# Altium schematic sheet Buck_60W20V_MCU_AuxPSU.SchDoc
size A4; SheetNumber: 4; SheetTotal: 7
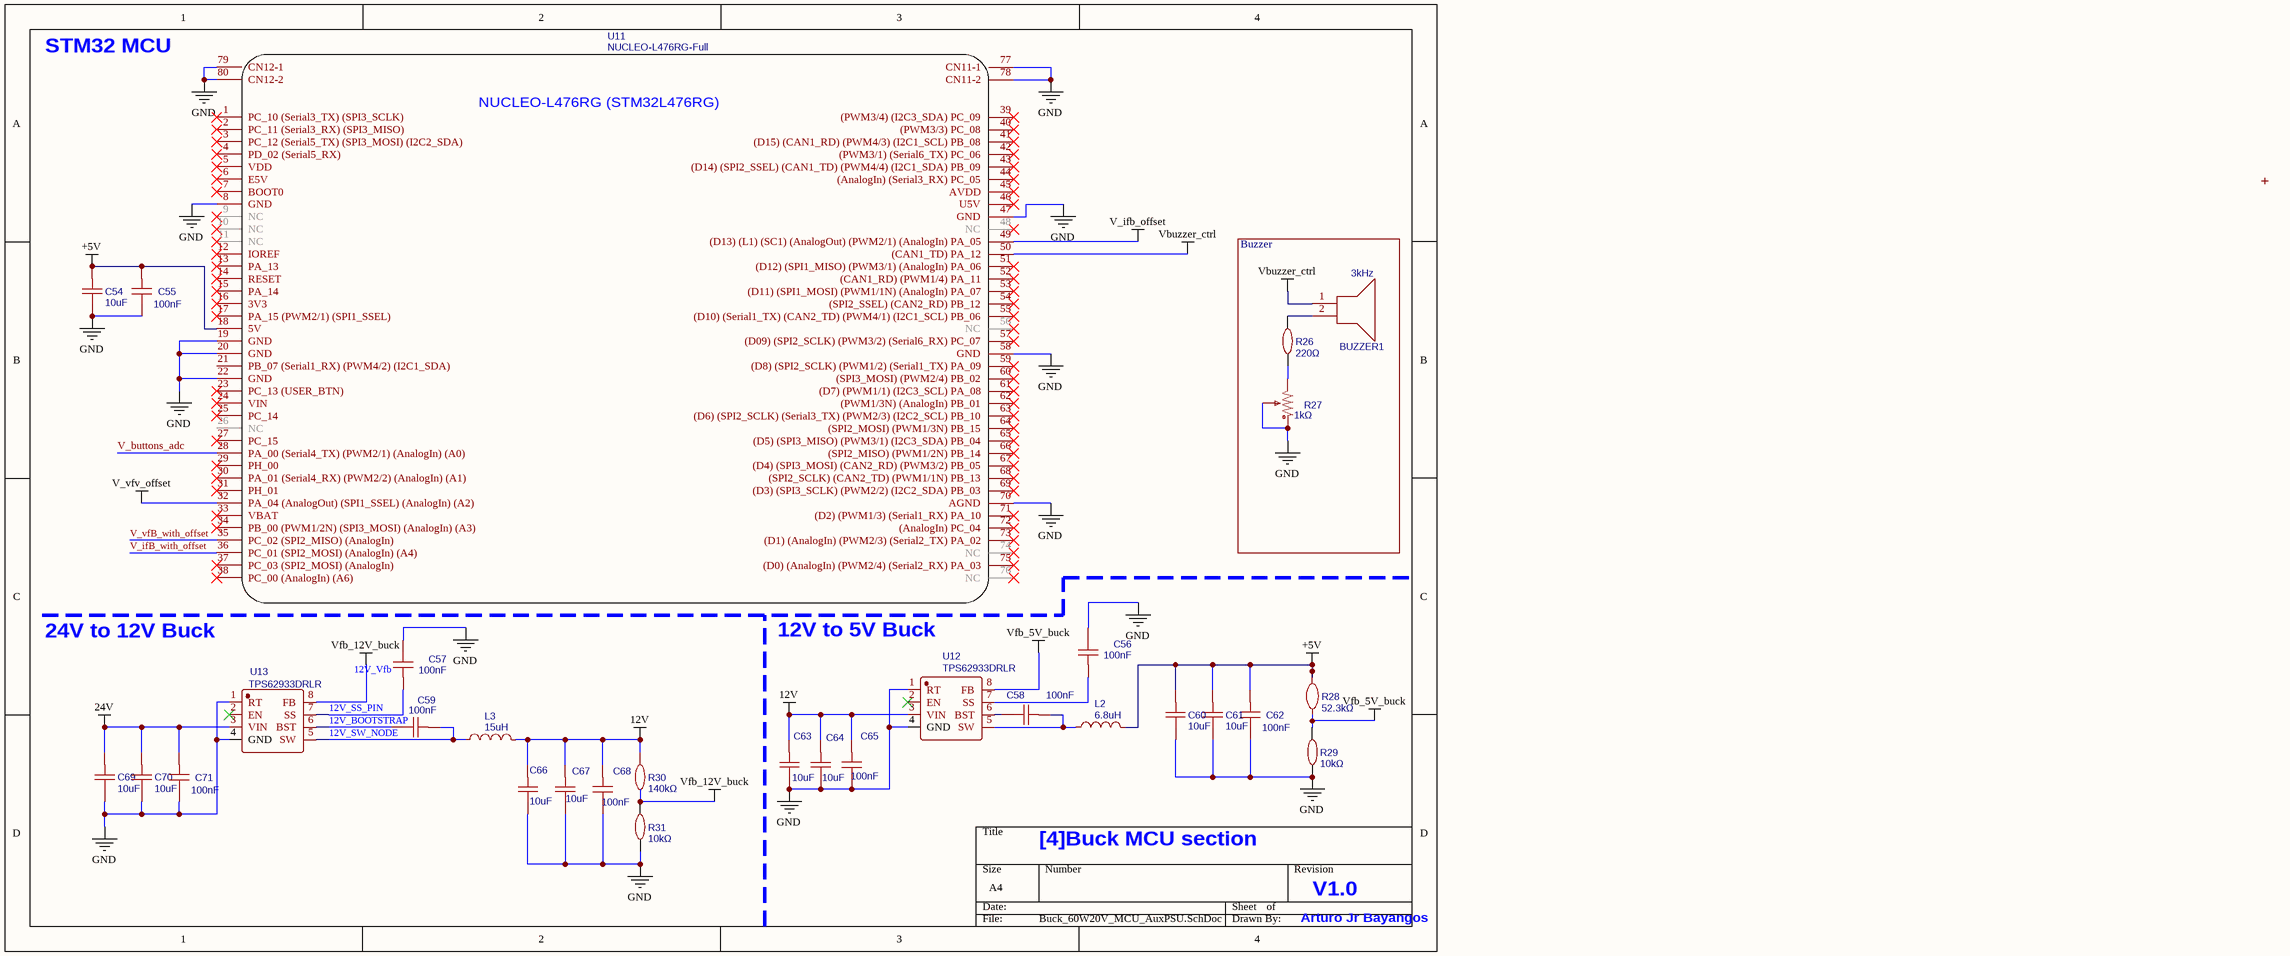
[diagram p0: Buck_60W20V_MCU_AuxPSU.SchDoc]

## Parts
BUZZER1  3kHz  [BUZ-TH_BD9.0-P5.00-D0.6-FD]
C54  10uF  [C1210]
C55  100nF  [C0402]
C56  100nF  [C0402]
C57  100nF  [C0402]
C58  100nF  [C0402]
C59  100nF  [C0402]
C60  10uF  [C1210]
C61  10uF  [C1210]
C62  100nF  [C0402]
C63  10uF  [C1210]
C64  10uF  [C1210]
C65  100nF  [C0402]
C66  10uF  [C1210]
C67  10uF  [C1210]
C68  100nF  [C0402]
C69  10uF  [C1210]
C70  10uF  [C1210]
C71  100nF  [C0402]
L2  6.8uH  [IND-SMD_L3.0-W3.0_LQH3NPN]
L3  15uH  [IND-SMD_L7.2-W6.9]
R26  220Ω  [R0603]
R27  1kΩ  [RES-ADJ-TH_3296W]
R28  52.3kΩ  [R0603]
R29  10kΩ  [R0603]
R30  140kΩ  [R0603]
R31  10kΩ  [R0603]
U11  NUCLEO-L476RG-Full  [MORPHO HEADER L476RG]
U12  TPS62933DRLR  [SOT-583-8_L2.1-W1.2-P0.50-LS1.6-BR]
U13  TPS62933DRLR  [SOT-583-8_L2.1-W1.2-P0.50-LS1.6-BR]

## Blocks framed on the sheet
Buzzer: BUZZER1 R26 R27

## Nets
12V: C63.2 C64.2 C65.2 C66.2 C67.2 C68.2 L3.2 R30.2 U12.3(VIN)
24V: C69.2 C70.2 C71.2 U13.3(VIN)
+5V: C54.2 C55.2 C60.2 C61.2 C62.2 L2.2 R28.2 U11.18(5V)
GND: C54.1 C55.1 C56.1 C57.1 C60.1 C61.1 C62.1 C63.1 C64.1 C65.1 C66.1 C67.1 C68.1 C69.1 C70.1 C71.1 R27.1 R27.2 R29.1 R31.1 U11.8(GND) U11.19(GND) U11.20(GND) U11.22(GND) U11.47(GND) U11.58(GND) U11.70(AGND) U11.77(CN11-1) U11.78(CN11-2) U11.79(CN12-1) U11.80(CN12-2) U12.1(RT) U12.4(GND) U13.1(RT) U13.4(GND)
V_ifb_offset: U11.49((D13)_(L1)_(SC1)_(AnalogOut)_(PWM2/1)_(AnalogIn)_PA_05)
V_vfv_offset: U11.32(PA_04_(AnalogOut)_(SPI1_SSEL)_(AnalogIn)_(A2))
Vbuzzer_ctrl: BUZZER1.1(+) U11.50((CAN1_TD)_PA_12)
Vfb_5V_buck: R28.1 R29.2 U12.8(FB)
Vfb_12V_buck: R30.1 R31.2 U13.8(FB)
12V_BOOTSTRAP: C59.1 U13.6(BST)
12V_SS_PIN: C57.2 U13.7(SS)
12V_SW_NODE: C59.2 L3.1 U13.5(SW)
V_buttons_adc: U11.28(PA_00_(Serial4_TX)_(PWM2/1)_(AnalogIn)_(A0))
V_ifB_with_offset: U11.36(PC_01_(SPI2_MOSI)_(AnalogIn)_(A4))
V_vfB_with_offset: U11.35(PC_02_(SPI2_MISO)_(AnalogIn))
NetBUZZER1_2: BUZZER1.2(-) R26.2
NetC56_2: C56.2 U12.7(SS)
NetC58_1: C58.1 U12.6(BST)
NetC58_2: C58.2 L2.1 U12.5(SW)
NetR26_1: R26.1 R27.3

Not connected (* = marked no-connect by the designer): U11 1(PC_10_(Serial3_TX)_(SPI3_SCLK))* 2(PC_11_(Serial3_RX)_(SPI3_MISO))* 3(PC_12_(Serial5_TX)_(SPI3_MOSI)_(I2C2_SDA))* 4(PD_02_(Serial5_RX))* 5(VDD)* 6(E5V)* 7(BOOT0)* 9(NC)* 10(NC)* 11(NC)* 12(IOREF)* 13(PA_13)* 14(RESET)* 15(PA_14)* 16(3V3)* 17(PA_15_(PWM2/1)_(SPI1_SSEL))* 21(PB_07_(Serial1_RX)_(PWM4/2)_(I2C1_SDA)) 23(PC_13_(USER_BTN))* 24(VIN)* 25(PC_14)* 26(NC) 27(PC_15)* 29(PH_00)* 30(PA_01_(Serial4_RX)_(PWM2/2)_(AnalogIn)_(A1))* 31(PH_01)* 33(VBAT)* 34(PB_00_(PWM1/2N)_(SPI3_MOSI)_(AnalogIn)_(A3))* 37(PC_03_(SPI2_MOSI)_(AnalogIn))* 38(PC_00_(AnalogIn)_(A6))* 39((PWM3/4)_(I2C3_SDA)_PC_09)* 40((PWM3/3)_PC_08)* 41((D15)_(CAN1_RD)_(PWM4/3)_(I2C1_SCL)_PB_08)* 42((PWM3/1)_(Serial6_TX)_PC_06)* 43((D14)_(SPI2_SSEL)_(CAN1_TD)_(PWM4/4)_(I2C1_SDA)_PB_09)* 44((AnalogIn)_(Serial3_RX)_PC_05)* 45(AVDD)* 46(U5V)* 48(NC)* 51((D12)_(SPI1_MISO)_(PWM3/1)_(AnalogIn)_PA_06)* 52((CAN1_RD)_(PWM1/4)_PA_11)* 53((D11)_(SPI1_MOSI)_(PWM1/1N)_(AnalogIn)_PA_07)* 54((SPI2_SSEL)_(CAN2_RD)_PB_12)* 55((D10)_(Serial1_TX)_(CAN2_TD)_(PWM4/1)_(I2C1_SCL)_PB_06)* 56(NC)* 57((D09)_(SPI2_SCLK)_(PWM3/2)_(Serial6_RX)_PC_07)* 59((D8)_(SPI2_SCLK)_(PWM1/2)_(Serial1_TX)_PA_09)* 60((SPI3_MOSI)_(PWM2/4)_PB_02)* 61((D7)_(PWM1/1)_(I2C3_SCL)_PA_08)* 62((PWM1/3N)_(AnalogIn)_PB_01)* 63((D6)_(SPI2_SCLK)_(Serial3_TX)_(PWM2/3)_(I2C2_SCL)_PB_10)* 64((SPI2_MOSI)_(PWM1/3N)_PB_15)* 65((D5)_(SPI3_MISO)_(PWM3/1)_(I2C3_SDA)_PB_04)* 66((SPI2_MISO)_(PWM1/2N)_PB_14)* 67((D4)_(SPI3_MOSI)_(CAN2_RD)_(PWM3/2)_PB_05)* 68((SPI2_SCLK)_(CAN2_TD)_(PWM1/1N)_PB_13)* 69((D3)_(SPI3_SCLK)_(PWM2/2)_(I2C2_SDA)_PB_03)* 71((D2)_(PWM1/3)_(Serial1_RX)_PA_10)* 72((AnalogIn)_PC_04)* 73((D1)_(AnalogIn)_(PWM2/3)_(Serial2_TX)_PA_02)* 74(NC)* 75((D0)_(AnalogIn)_(PWM2/4)_(Serial2_RX)_PA_03)* 76(NC)*; U12 2(EN)*; U13 2(EN)*

## Notes on the sheet
- STM32 MCU
- 24V to 12V Buck
- 12V to 5V Buck
- [4]Buck MCU section
- V1.0
- Arturo Jr Bayangos
- Labels drawn without touching a wire or pin: 12V_Vfb
- (in symbol NUCLEO-L476RG-Full) NUCLEO-L476RG (STM32L476RG)

## Library data of the parts
BUZZER1 = 3kHz: Manufacturer: 华能; Manufacturer Part: HNB09A03; Contributor: LCSC; nameAlias: Value; Supplier: LCSC; Supplier Part: C96102; JLCPCB Part Class: Extended Part; spicePre: B; spiceSymbolName: HNB09A03
C54 C60 C61 C63 C64 C66 C67 C69 C70 = 10uF: Manufacturer: TAIYO YUDEN(太诱); Manufacturer Part: UMK325AB7106KM-T; nameAlias: Capacitance; Contributor: LCSC; Supplier: LCSC; Supplier Part: C386167; JLCPCB Part Class: Extended Part; spicePre: C; spiceSymbolName: UMK325AB7106KM-T
C55-C59 C62 C65 C68 C71 = 100nF: Manufacturer: TAIYO YUDEN(太诱); Manufacturer Part: UMK105B7104KV-FR; nameAlias: Capacitance; Contributor: lcsc; Supplier: LCSC; Supplier Part: C2167491; JLCPCB Part Class: Extended Part; spicePre: C; spiceSymbolName: UMK105B7104KV-FR
L2 = 6.8uH: Manufacturer: muRata(村田); Manufacturer Part: LQH3NPN6R8MMEL; nameAlias: Value; Contributor: lcsc; Supplier: LCSC; Supplier Part: C703775; JLCPCB Part Class: Extended Part; spicePre: L; spiceSymbolName: LQH3NPN6R8MMEL
L3 = 15uH: Manufacturer: TDK; Manufacturer Part: SPM6545VT-150M-D; Contributor: lcsc; nameAlias: Value; Supplier: LCSC; Supplier Part: C2047917; JLCPCB Part Class: Extended Part; spicePre: L; spiceSymbolName: SPM6545VT-150M-D
R26 = 220Ω: Manufacturer: RALEC(旺诠); Manufacturer Part: RTT03221JTP; nameAlias: Value; Supplier: LCSC; Supplier Part: C103424; JLCPCB Part Class: Extended Part; spicePre: R; spiceSymbolName: RTT03221JTP
R27 = 1kΩ: Manufacturer: BOCHEN(博晨); Manufacturer Part: 3296W-1-102-8mm; Contributor: LCSC; nameAlias: Resistance; Supplier: LCSC; Supplier Part: C2766201; JLCPCB Part Class: Extended Part; spicePre: R; spiceSymbolName: 3296W-1-102_C2766201
R28 = 52.3kΩ: Manufacturer: PANASONIC(松下); Manufacturer Part: ERA3AEB5232V; Contributor: LCSC; nameAlias: Value; Supplier: LCSC; Supplier Part: C491140; JLCPCB Part Class: Extended Part; spicePre: R; spiceSymbolName: ERA3AEB5232V
R29 R31 = 10kΩ: Manufacturer: UNI-ROYAL(厚声); Manufacturer Part: 0603WAF1002T5E; nameAlias: Value; Supplier: LCSC; Supplier Part: C25804; JLCPCB Part Class: Basic Part; spicePre: R; spiceSymbolName: 0603WAF1002T5E
R30 = 140kΩ: Manufacturer: Viking(光颉); Manufacturer Part: ARG03FTC1403; nameAlias: Value; Contributor: LCSC; Supplier: LCSC; Supplier Part: C217735; JLCPCB Part Class: Extended Part; spicePre: R; spiceSymbolName: ARG03FTC1403
U11 = NUCLEO-L476RG-Full: Manufacturer Part: NUCLEO-F446RE; Contributor: ambi bayangos; Supplier Part: STM32F446RET6; Supplier: STM; link: https://developer.mbed.org/platforms/ST-Nucleo-F446RE/; spicePre: U; spiceSymbolName: NUCLEO-L476RG-Full
U12 U13 = TPS62933DRLR: Manufacturer: TI(德州仪器); Contributor: lcsc; Supplier: LCSC; Supplier Part: C3200405; JLCPCB Part Class: Extended Part; spicePre: U; spiceSymbolName: TPS62933DRLR